# EAGLE design BeagleQ-v03 (EAGLE 6.4)
BOARD_NUMBER: 1.0
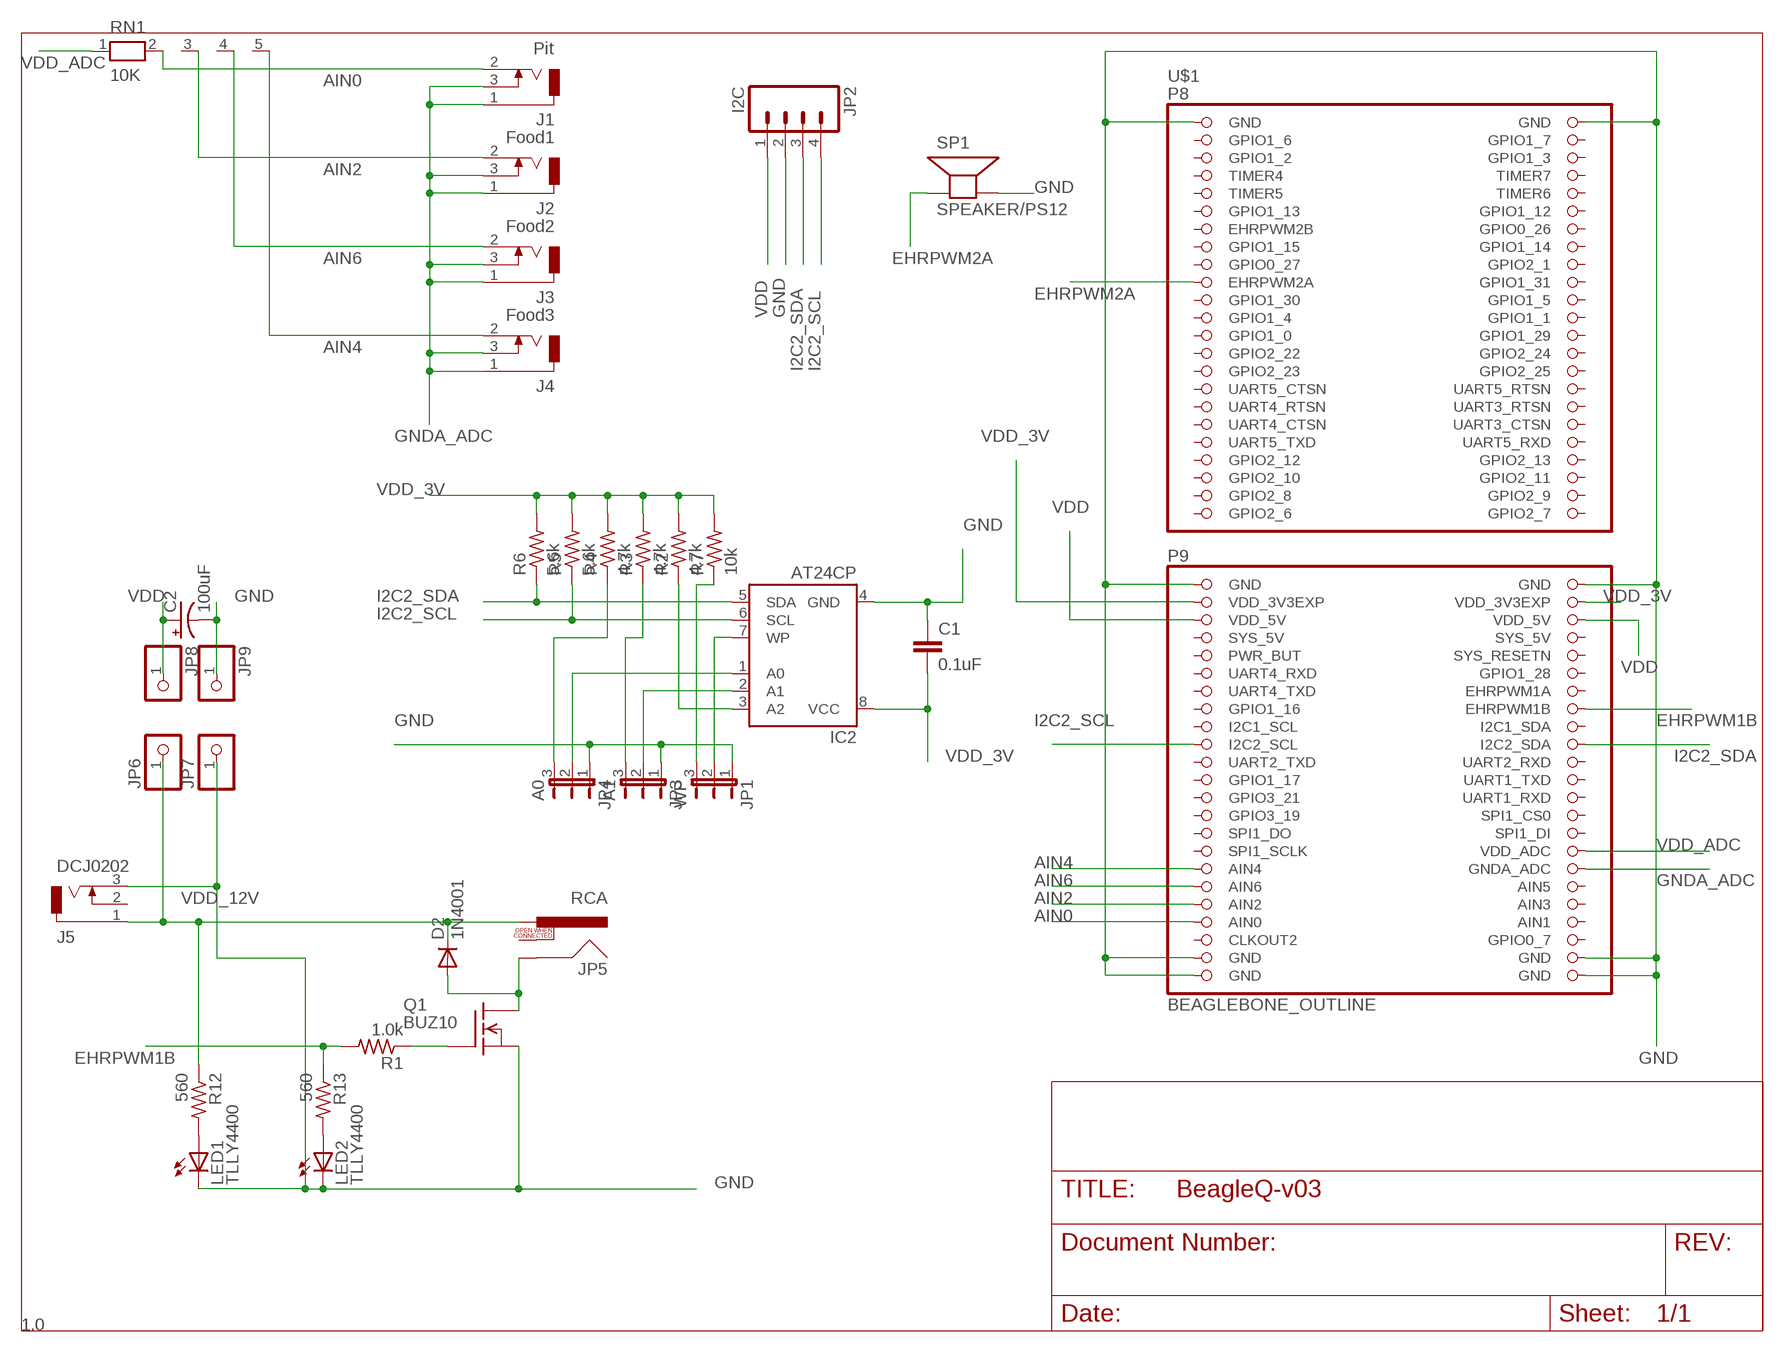
[diagram p0: schematic, sheet 1]
FRAME1 (LETTER_L): BOARD_NUMBER: 1.0

## Parts
C1  0.1uF  C2.5/2  [C2.5-2]
C2  100uF  CPOL-USE2,5-6E  [E2,5-6E]
D2  1N4001  1N4004  [DO41-10]
IC2  AT24CP  [DIL08]
J1  Pit  DCJ0202  [DCJ0202]
J2  Food1  DCJ0202  [DCJ0202]
J3  Food2  DCJ0202  [DCJ0202]
J4  Food3  DCJ0202  [DCJ0202]
J5  DCJ0202  [DCJ0202]
JP1  WP  JP2E  [JP2]
JP2  I2C  M04PTH  [1X04]
JP3  A1  JP2E  [JP2]
JP4  A0  JP2E  [JP2]
JP5  RCA  [RCA]
JP6  PINHD-1X1  [1X01]
JP7  PINHD-1X1  [1X01]
JP8  PINHD-1X1  [1X01]
JP9  PINHD-1X1  [1X01]
LED1  TLLY4400  [LED3MM]
LED2  TLLY4400  [LED3MM]
Q1  BUZ10  [TO220]
R1  1.0k  R-US_0207/10  [0207/10]
R2  4.7k  R-US_0207/10  [0207/10]
R3  4.7k  R-US_0207/10  [0207/10]
R4  4.7k  R-US_0207/10  [0207/10]
R5  5.6k  R-US_0207/10  [0207/10]
R6  5.6k  R-US_0207/10  [0207/10]
R7  10k  R-US_0207/10  [0207/10]
R12  560  R-US_0207/10  [0207/10]
R13  560  R-US_0207/10  [0207/10]
RN1  10K  RN04  [RN-5]
SP1  SPEAKER/PS12  [PS12]
U$1  BEAGLEBONE_OUTLINE  [BEAGLEBONE_SHIELD]

## Nets
AIN0: J1.2 RN1.2 U$1.85(AIN0)
AIN2: J2.2 RN1.3 U$1.83(AIN2)
AIN4: J4.2 RN1.5 U$1.79(AIN4)
AIN6: J3.2 RN1.4 U$1.81(AIN6)
BLOWER_L [VCC_12V]: D2.A JP5.SHELL Q1.2(D)
EHRPWM1B: R1.2 R13.1 U$1.62(EHRPWM1B)
EHRPWM2A: SP1.P$1(+) U$1.19(EHRPWM2A)
GND [GND]: C1.1 C2.- IC2.4(GND) J5.3 JP1.1 JP2.2 JP3.1 JP4.1 JP7.1 JP9.1 LED1.K(C) LED2.K(C) Q1.3(S) SP1.P$2(-) U$1.1(GND) U$1.2(GND) U$1.47(GND) U$1.48(GND) U$1.89(GND) U$1.90(GND) U$1.91(GND) U$1.92(GND)
GNDA_ADC: J1.1 J1.3 J2.1 J2.3 J3.1 J3.3 J4.1 J4.3 U$1.80(GNDA_ADC)
I2C2_SCL: IC2.6(SCL) JP2.4 R5.1 U$1.65(I2C2_SCL)
I2C2_SDA: IC2.5(SDA) JP2.3 R6.1 U$1.66(I2C2_SDA)
N$1: IC2.2(A1) JP3.2
N$2: IC2.1(A0) JP4.2
N$3: IC2.7(WP) JP1.2
N$4: Q1.1(G) R1.1
N$5: JP1.3 R7.1
N$6: JP3.3 R3.1
N$7: JP4.3 R4.1
N$8: LED1.A R12.2
N$9: IC2.3(A2) R2.1
N$10: LED2.A R13.2
VDD [VDD]: C2.+ JP2.1 JP8.1 U$1.51(VDD_5V) U$1.52(VDD_5V)
VDD_3V: C1.2 IC2.8(VCC) R2.2 R3.2 R4.2 R5.2 R6.2 R7.2 U$1.49(VDD_3V3EXP) U$1.50(VDD_3V3EXP)
VDD_12V [VCC_12V]: D2.C J5.1 JP5.PIN JP6.1 R12.1
VDD_ADC: RN1.1 U$1.78(VDD_ADC)
Unconnected: J5.2 JP5.SWITCH U$1.3(GPIO1_6) U$1.4(GPIO1_7) U$1.5(GPIO1_2) U$1.6(GPIO1_3) U$1.7(TIMER4) U$1.8(TIMER7) U$1.9(TIMER5) U$1.10(TIMER6) U$1.11(GPIO1_13) U$1.12(GPIO1_12) U$1.13(EHRPWM2B) U$1.14(GPIO0_26) U$1.15(GPIO1_15) U$1.16(GPIO1_14) U$1.17(GPIO0_27) U$1.18(GPIO2_1) U$1.20(GPIO1_31) U$1.21(GPIO1_30) U$1.22(GPIO1_5) U$1.23(GPIO1_4) U$1.24(GPIO1_1) U$1.25(GPIO1_0) U$1.26(GPIO1_29) U$1.27(GPIO2_22) U$1.28(GPIO2_24) U$1.29(GPIO2_23) U$1.30(GPIO2_25) U$1.31(UART5_CTSN) U$1.32(UART5_RTSN) U$1.33(UART4_RTSN) U$1.34(UART3_RTSN) U$1.35(UART4_CTSN) U$1.36(UART3_CTSN) U$1.37(UART5_TXD) U$1.38(UART5_RXD) U$1.39(GPIO2_12) U$1.40(GPIO2_13) U$1.41(GPIO2_10) U$1.42(GPIO2_11) U$1.43(GPIO2_8) U$1.44(GPIO2_9) U$1.45(GPIO2_6) U$1.46(GPIO2_7) U$1.54(SYS_5V) U$1.55(PWR_BUT) U$1.56(SYS_RESETN) U$1.57(UART4_RXD) U$1.58(GPIO1_28) U$1.59(UART4_TXD) U$1.60(EHRPWM1A) U$1.61(GPIO1_16) U$1.63(I2C1_SCL) U$1.64(I2C1_SDA) U$1.67(UART2_TXD) U$1.68(UART2_RXD) U$1.69(GPIO1_17) U$1.70(UART1_TXD) U$1.71(GPIO3_21) U$1.72(UART1_RXD) U$1.73(GPIO3_19) U$1.74(SPI1_CS0) U$1.75(SPI1_DO) U$1.76(SPI1_DI) U$1.77(SPI1_SCLK) U$1.82(AIN5) U$1.84(AIN3) U$1.86(AIN1) U$1.87(CLKOUT2) U$1.88(GPIO0_7)

## Power pins joined to a net without a drawn wire
SYS_5V: U$1.53(SYS_5V)

## Library data of the parts
C1 = capacitor-wima:C: CAPACITOR naming: grid - package width
C2 = rcl:CPOL-US: POLARIZED CAPACITOR, American symbol
D2 = adafruit:1N4004: DIODE General purpose 1N400x type rectifier (With bigger pads) http://www.ladyada.net/library/pcb/eaglelibrary.html
IC2 = atmel:AT24C*: 2-wire serial EEPROM; MPN: AT24C1024BW-SH-B; OC_FARNELL: 1362646; OC_NEWARK: 03P2044
J1-J4 = houseofbeck:DCJ0202: AUDIO JACK Source: MJ2508.pdf
J5 = con-jack:DCJ0202: DC POWER JACK Source: DCJ0202.pdf; OC_FARNELL: unknown; OC_NEWARK: unknown
JP1 JP3 JP4 = jumper:JP2E: JUMPER
JP2 = SparkFun-Connectors:M04: Header 4 Standard 4-pin 0.1" header. Use with straight break away headers (SKU : PRT-00116), right angle break away headers (PRT-00553), swiss pins (PRT-00743), machine pins (PRT-00117), and female headers (PRT-00115). Molex polarized connector foot print use with SKU : PRT-08231 with associated crimp pins and housings. 1MM SMD Version SKU: PRT-10208
JP5 = SparkFun-Connectors:RCA
JP6-JP9 = pinhead:PINHD-1X1: PIN HEADER
LED1 LED2 = led:TLLY4400: Low Current (2mA) LED 3 mm Tinted Diffused Package color YELLOW Source: Data sheet <http://www.farnell.com/datasheets/391098.pdf>; MF: VISHAY SEMICONDUCTOR; OC_FARNELL: 1612439
Q1 = transistor-fet:BUZ10: N-Channel Enhancement MOSFET 50V; 20A; 0,080Ohm
R1-R7 R12 R13 = resistor:R-US_: RESISTOR, American symbol
RN1 = resistor-net:RN04: RESISTOR NETWORK; OC_FARNELL: unknown; OC_NEWARK: unknown
SP1 = adafruit:SPEAKER: SPEAKER Source: Buerklin Added PS12 (for part # PS1240 piezo) http://www.ladyada.net/library/pcb/eaglelibrary.html
U$1 = houseofbeck:BEAGLEBONE_OUTLINE: Should match A3 pinout - but not completely tested

## Net classes
0 default: width 0.203 mm
1 VCC_12V: width 0.305 mm, drill 0.406 mm
2 VDD: width 0.305 mm, drill 0.406 mm
3 GND: width 0.254 mm, drill 0.406 mm

## Board
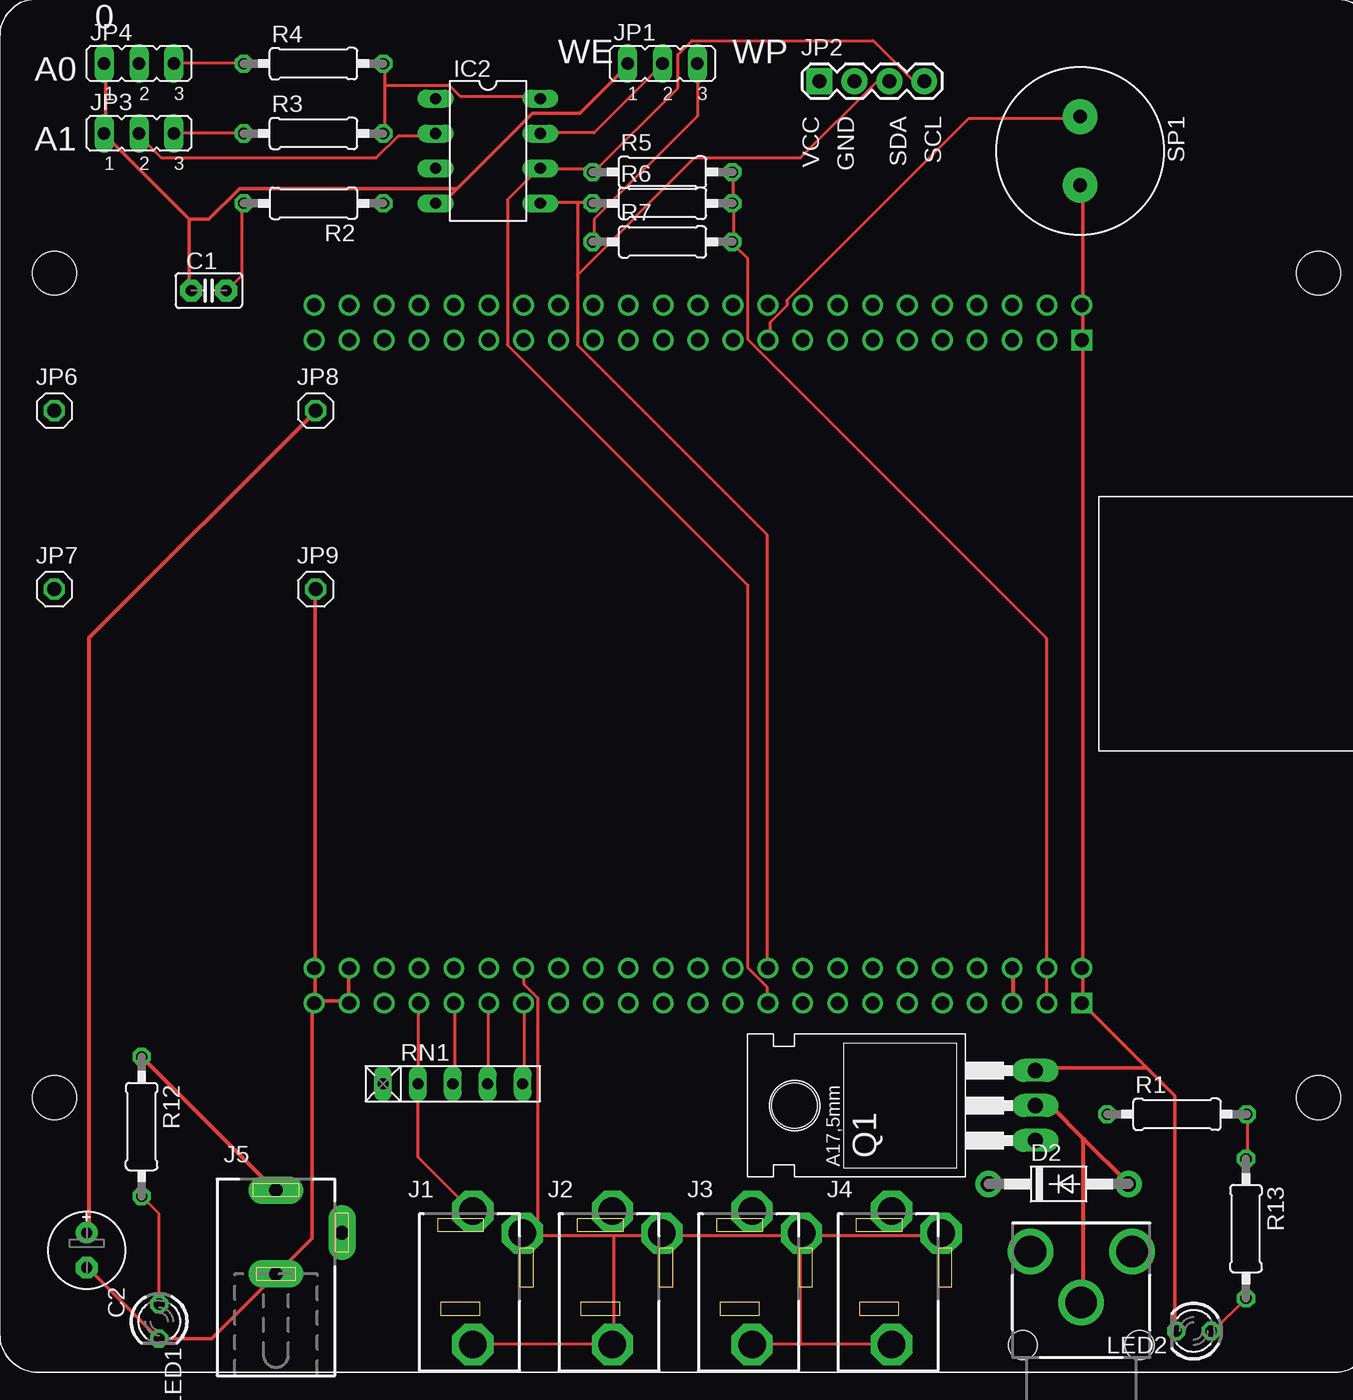
[diagram p1: board, top side]
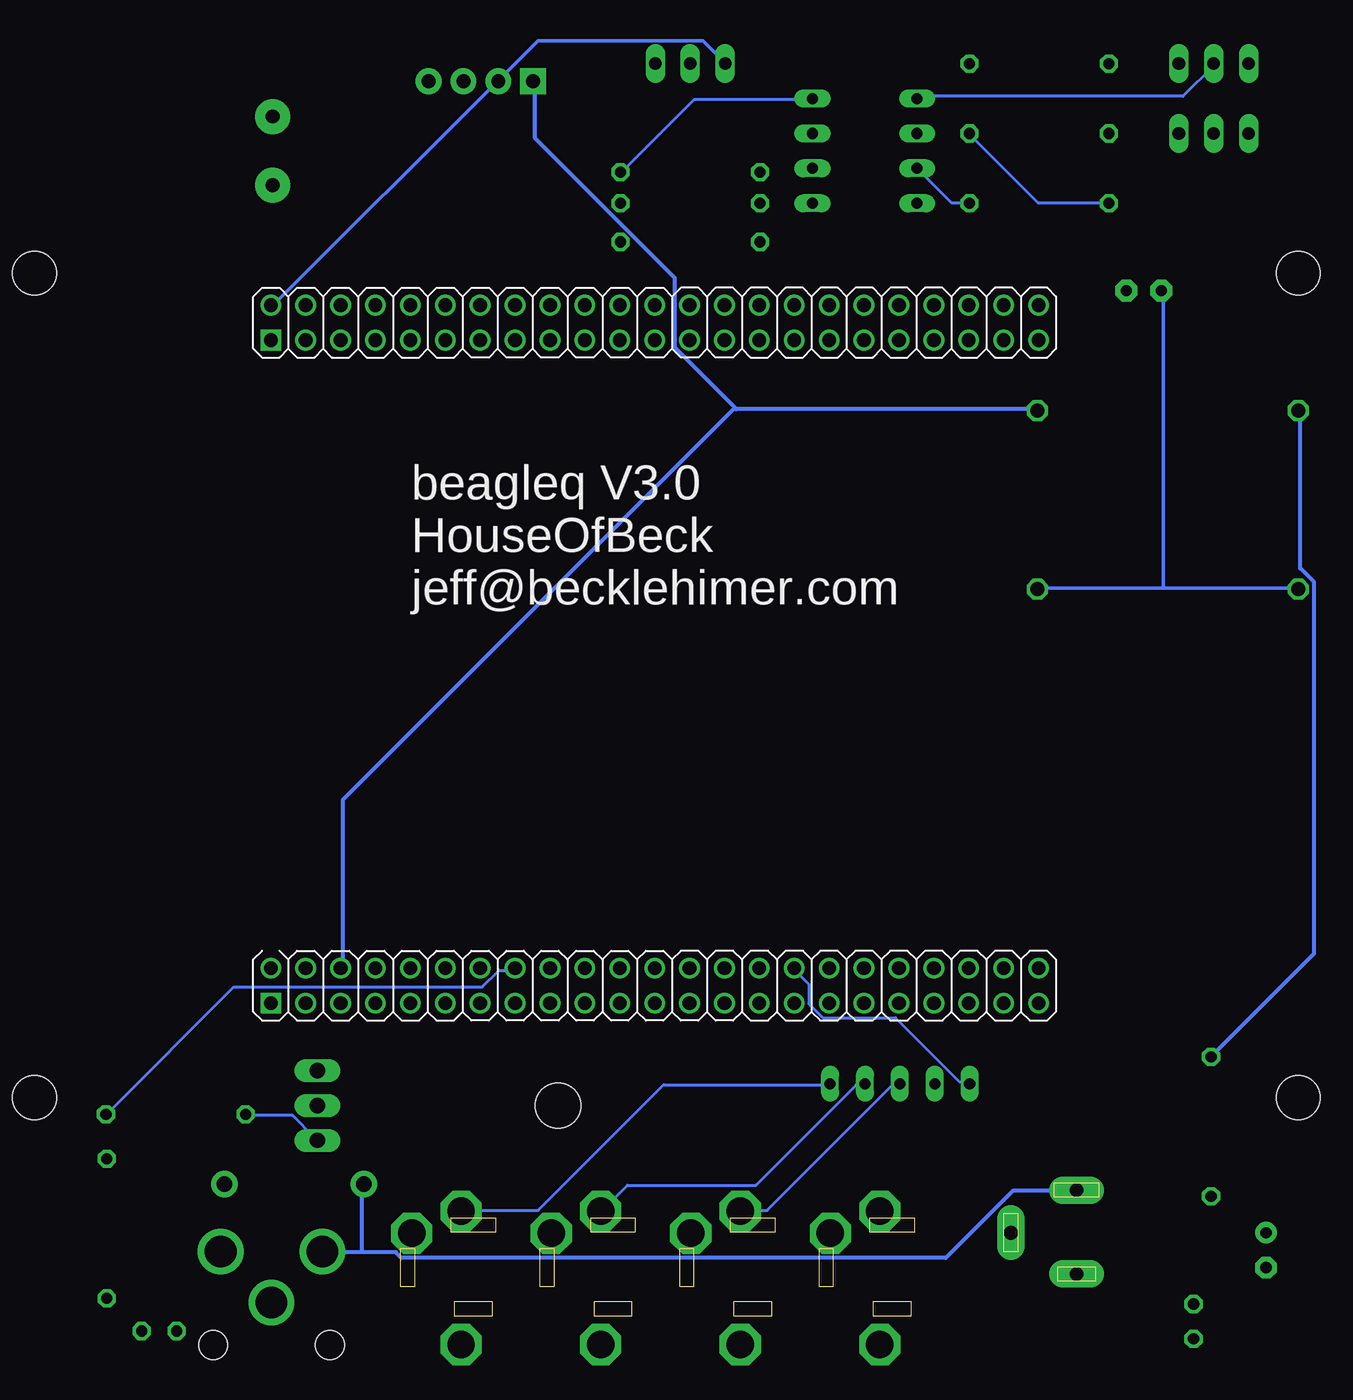
[diagram p2: board, bottom side, seen from below]

No outline drawn. Coordinates in mm, seen from the top.
Copper layers (1*16): Top 0.035mm / dielectric 1.5mm / Bottom 0.035mm
Design rules "dirt_cheap_dirty_boards.v1": minimum track width 5mil, minimum drill 12mil, track to track 5mil, track to pad 5mil, pad to pad 5mil, via to via 5mil, smd to smd 0mil, copper to edge 10mil, drill to drill 10mil, minimum pad ring 10mil, minimum via ring 6mil, stop-mask expansion 2mil, vias tented up to drill 25mil, thermal gap 10mil

### Footprints (pad centres in the part's own frame; a part is rotated, then mirrored left to right if it is on the bottom)
C2.5-2 = drill 0.813 pad 1.6 octagon: 1 -1.27,0; 2 1.27,0
E2,5-6E = drill 0.813 pad 1.575: + -1.27,0 | drill 0.813 pad 1.575 octagon: - 1.27,0
DO41-10 = drill 1.118 pad 1.93: A 5.08,0; C -5.08,0
DIL08 = drill 0.813 long: 1 -3.81,-3.81; 2 -1.27,-3.81; 3 1.27,-3.81; 4 3.81,-3.81; 5 3.81,3.81; 6 1.27,3.81; 7 -1.27,3.81; 8 -3.81,3.81
DCJ0202 = drill 2 pad 2.54 octagon: 1 0.9,-5.6; 2 0.9,4.1; 3 4.5,2.5
DCJ0202' = drill 1 pad 2 long: 1 0,3.1; 2 4.8,0; 3 0,-3
JP2 = drill 0.914 long: 1 -2.54,0; 2 0,0; 3 2.54,0
1X04 = drill 1.016 pad 1.88 square: 1 0,0 | drill 1.016 pad 1.88: 2 2.54,0; 3 5.08,0; 4 7.62,0
RCA = drill 2.3: PIN 3.7,3.7; SHELL 0,0; SWITCH 3.7,-3.7 | hole 2.1: -3.1,4.25; -3.1,-4.25
1X01 = drill 1.016 octagon: 1 0,0
LED3MM = drill 0.813 octagon: A -1.27,0; K 1.27,0
TO220 = drill 1.118 long: 1 -2.54,-6.35; 2 0,-6.35; 3 2.54,-6.35 | hole 3.302: 0,11.176
0207/10 = drill 0.813 octagon: 1 -5.08,0; 2 5.08,0
RN-5 = drill 0.813 long: 1 -5.08,0; 2 -2.54,0; 3 0,0; 4 2.54,0; 5 5.08,0
PS12 = drill 1 pad 2.54: P$1 -2.5,0; P$2 2.5,0
BEAGLEBONE_SHIELD = drill 1 square: 1 78.79,75.135; 47 78.79,26.875 | drill 1: 2 78.79,77.675; 3 76.25,75.135; 4 76.25,77.675; 5 73.71,75.135; 6 73.71,77.675; 7 71.17,75.135; 8 71.17,77.675; 9 68.63,75.135; 10 68.63,77.675; 11 66.09,75.135; 12 66.09,77.675; 13 63.55,75.135; 14 63.55,77.675; 15 61.01,75.135; 16 61.01,77.675; 17 58.47,75.135; 18 58.47,77.675; 19 55.93,75.135; 20 55.93,77.675; 21 53.39,75.135; 22 53.39,77.675; 23 50.85,75.135; 24 50.85,77.675; 25 48.31,75.135; 26 48.31,77.675; 27 45.77,75.135; 28 45.77,77.675; 29 43.23,75.135; 30 43.23,77.675; 31 40.69,75.135; 32 40.69,77.675; 33 38.15,75.135; 34 38.15,77.675; 35 35.61,75.135; 36 35.61,77.675; 37 33.07,75.135; 38 33.07,77.675; 39 30.53,75.135; 40 30.53,77.675; 41 27.99,75.135; 42 27.99,77.675; 43 25.45,75.135; 44 25.45,77.675; 45 22.91,75.135; 46 22.91,77.675; 48 78.79,29.415; 49 76.25,26.875; 50 76.25,29.415; 51 73.71,26.875; 52 73.71,29.415; 53 71.17,26.875; 54 71.17,29.415; 55 68.63,26.875; 56 68.63,29.415; 57 66.09,26.875; 58 66.09,29.415; 59 63.55,26.875; 60 63.55,29.415; 61 61.01,26.875; 62 61.01,29.415; 63 58.47,26.875; 64 58.47,29.415; 65 55.93,26.875; 66 55.93,29.415; 67 53.39,26.875; 68 53.39,29.415; 69 50.85,26.875; 70 50.85,29.415; 71 48.31,26.875; 72 48.31,29.415; 73 45.77,26.875; 74 45.77,29.415; 75 43.23,26.875; 76 43.23,29.415; 77 40.69,26.875; 78 40.69,29.415; 79 38.15,26.875; 80 38.15,29.415; 81 35.61,26.875; 82 35.61,29.415; 83 33.07,26.875; 84 33.07,29.415; 85 30.53,26.875; 86 30.53,29.415; 87 27.99,26.875; 88 27.99,29.415; 89 25.45,26.875; 90 25.45,29.415; 91 22.91,26.875; 92 22.91,29.415 | hole 3.2: 4,80; 96,80; 96,20; 4,20

### Placement (x,y rotation side)
C1  15.24,78.74 0 top
C2  6.35,8.89 270 top
D2  77.09,13.71 0 top
IC2  35.56,88.9 270 top
J1  33.56,7.62 0 top
J2  43.72,7.62 0 top
J3  53.88,7.62 0 top
J4  64.04,7.62 0 top
J5  DCJ0202  [DCJ0202']  20.13,10.16 0 top
JP1  48.26,95.25 0 top
JP2  59.69,93.98 0 top
JP3  10.16,90.17 0 top
JP4  10.16,95.25 0 top
JP5  78.74,5.08 90 top
JP6  4,70 0 top
JP7  4,57 0 top
JP8  23,70 0 top
JP9  23,57 0 top
LED1  11.62,3.7 270 top
LED2  86.92,3 180 top
Q1  69.05,19.42 90 top
R1  85.71,18.78 0 top
R2  22.86,85.09 180 top
R3  22.86,90.17 0 top
R4  22.86,95.25 0 top
R5  48.26,87.36 0 top
R6  48.26,85.09 0 top
R7  48.26,82.28 0 top
R12  10.35,17.89 270 top
R13  90.73,10.46 270 top
RN1  33,21 0 top
SP1  78.66,88.9 270 top
U$1  0,0 0 top

### Tracks (layer width: path | path; a pad name or v marks a point on that pad's centre or on a via)
AIN0
  Top 0.203: U$1.85 30.48,26.82 30.48,21.13 RN1.2 30.48,20.93 30.48,15.65 34.34,11.79 J1.2
AIN2
  Top 0.203: RN1.3 33.12,21.13 33.12,26.82 U$1.83
  Bottom 0.203: RN1.3 33.12,20.93 33.53,20.93 42.67,11.79 44.5,11.79 J2.2
AIN4
  Top 0.203: RN1.5 38.2,21.13 38.2,26.82 U$1.79
  Bottom 0.203: RN1.5 38.2,20.93 50.19,20.93 59.33,11.79 64.82,11.79 J4.2
AIN6
  Top 0.203: RN1.4 35.56,21.13 35.56,26.82 U$1.81
  Bottom 0.203: RN1.4 35.56,20.93 36.17,20.93 43.48,13.61 52.83,13.61 54.66,11.79 J3.2
BLOWER_L
  Top 0.305: 75.39,19.3 Q1.2 75.59,19.3 76.61,19.3 78.94,16.97 | 78.94,16.97 82.09,13.82 D2.A | JP5.SHELL 78.84,5.08 78.84,16.87 78.94,16.97
EHRPWM1B
  Top 0.203: R13.1 90.83,15.65 90.83,18.69 R1.2
  Bottom 0.203: U$1.62 61.16,29.26 62.18,29.26 63.4,28.04 81.48,28.04 90.63,18.9 R1.2
EHRPWM2A
  Top 0.203: U$1.19 56.08,75.18 56.08,76.4 57.3,77.62 57.3,78.03 70.51,91.24 78.64,91.24 SP1.P$1
GND
  Top 0.254: 22.96,27.03 22.96,29.26 U$1.92 22.96,29.46 22.96,56.9 JP9.1 | 25.4,27.03 25.4,29.26 U$1.90 | 25.4,27.03 22.96,27.03 | 22.96,27.03 U$1.91 22.76,26.82 22.76,9.75 20.32,7.32 J5.3 20.12,7.11 15.44,2.44 11.79,2.44 LED1.K 11.58,2.44 6.5,7.52 C2.- | 25.4,27.03 U$1.89 | JP4.1 7.72,95.1 7.72,90.22 JP3.1 7.72,90.02 13.82,83.92 | 13.82,83.92 13.82,78.84 C1.1 | 83.52,22.15 78.84,26.82 U$1.47 78.84,27.03 78.84,29.26 U$1.48 78.84,29.46 78.84,74.98 U$1.1 78.84,75.18 78.84,77.62 U$1.2 78.84,77.83 78.84,86.36 SP1.P$2 | 83.52,22.15 75.59,22.15 Q1.3 | 33.33,86.16 38.81,91.64 42.27,91.64 45.72,95.1 JP1.1 | 33.33,86.16 32.31,85.14 31.9,85.14 IC2.4 | 13.82,83.92 15.24,83.92 17.48,86.16 33.33,86.16 | 83.52,22.15 85.55,20.12 85.55,3.05 LED2.K
  Bottom 0.254: 13.82,57.1 22.96,57.1 JP9.1 | 13.82,57.1 4.06,57.1 JP7.1 | 13.82,57.1 13.82,78.64 C1.1 | JP1.1 45.72,95.3 47.35,96.93 59.33,96.93 62.18,94.08 JP2.2 62.38,93.88 78.64,77.62 U$1.2
GNDA_ADC
  Top 0.203: 58.32,2.03 64.82,2.03 J4.1 | 58.32,2.03 54.86,2.03 J3.1 | 58.32,2.03 58.32,9.96 | J4.3 68.48,9.96 58.52,9.96 J3.3 58.32,9.96 | J1.1 34.54,2.03 44.5,2.03 J2.1 44.7,2.03 44.7,9.96 | U$1.80 38.2,29.26 38.2,28.25 39.22,27.23 39.22,11.18 38.2,10.16 J1.3 38.2,9.96 44.7,9.96 | 44.7,9.96 48.16,9.96 J2.3 48.36,9.96 58.32,9.96
I2C2_SCL
  Top 0.203: U$1.65 55.88,27.03 55.88,28.04 54.46,29.46 54.46,57.3 36.98,74.78 36.98,85.34 39.22,87.58 IC2.6 39.42,87.58 42.88,87.58 43.08,87.38 R5.1 43.28,87.38 49.38,93.47 49.38,95.91 50.39,96.93 63.6,96.93 66.45,94.08 67.26,94.08 JP2.4
I2C2_SDA
  Top 0.203: 42.06,85.14 43.08,85.14 R6.1 | 42.06,85.14 39.42,85.14 IC2.5 | 42.06,85.14 42.06,79.86 | 42.06,79.86 42.06,74.78 55.88,60.96 55.88,29.46 U$1.66 | 42.06,79.86 50.6,88.39 58.32,88.39 63.8,93.88 64.62,93.88 JP2.3
N$1
  Top 0.203: IC2.2 31.7,90.02 29.06,90.02 27.43,88.39 11.79,88.39 10.16,90.02 JP3.2
N$2
  Bottom 0.203: IC2.1 31.7,92.86 12.39,92.86 10.16,95.1 JP4.2
N$3
  Top 0.203: IC2.7 39.42,90.22 43.28,90.22 48.16,95.1 JP1.2
N$4
  Bottom 0.203: R1.1 80.47,18.69 77.22,18.69 75.59,17.07 Q1.1
N$5
  Top 0.203: JP1.3 50.8,91.44 43.28,83.92 43.28,82.3 R7.1
N$6
  Top 0.203: R3.1 17.68,90.22 12.8,90.22 JP3.3
N$7
  Top 0.203: R4.1 17.68,95.3 12.8,95.3 JP4.3
N$8
  Top 0.203: LED1.A 11.58,5.08 11.58,11.58 10.36,12.8 R12.2
N$9
  Bottom 0.203: IC2.3 29.26,85.14 28.04,85.14 R2.1
N$10
  Top 0.203: LED2.A 88.39,3.05 90.63,5.28 R13.2
VDD
  Top 0.305: U$1.51 73.76,27.03 73.76,29.26 U$1.52 | C2.+ 6.5,10.16 6.5,53.44 22.96,69.9 JP8.1
  Bottom 0.305: 45.01,70.21 44.91,70.1 23.16,70.1 JP8.1 | 45.01,70.21 49.38,74.57 49.38,79.65 59.54,89.81 59.54,93.88 JP2.1 | 45.01,70.21 73.56,41.66 73.56,29.46 U$1.52
VDD_3V
  Top 0.203: R2.2 17.68,84.94 17.68,79.86 16.66,78.84 C1.2 | 28.04,93.67 28.04,95.1 R4.2 | 28.04,93.67 28.04,90.22 R3.2 | 28.04,93.67 32.72,93.67 33.53,92.86 39.22,92.86 IC2.8 | U$1.49 76.2,27.03 76.2,29.26 U$1.50 76.2,29.46 76.2,53.44 54.46,75.18 54.46,81.08 53.44,82.09 R7.2 53.44,82.3 53.44,84.94 R6.2 53.44,85.14 53.44,87.17 R5.2
  Bottom 0.203: R2.2 17.88,85.14 22.96,85.14 27.84,90.02 R3.2 | IC2.8 39.42,92.66 47.95,92.66 53.24,87.38 R5.2
VDD_12V
  Top 0.305: R12.1 10.36,22.96 20.12,13.21 J5.1
  Bottom 0.305: JP6.1 3.86,69.9 3.86,58.52 2.85,57.51 2.85,30.48 10.16,23.16 R12.1 | 72.14,8.74 69.7,8.74 69.29,8.33 29.67,8.33 24.79,13.21 20.32,13.21 J5.1 | 72.14,8.74 74.98,8.74 JP5.PIN | 72.14,8.74 72.14,13.61 D2.C
VDD_ADC
  Bottom 0.203: RN1.1 28.04,21.13 28.65,21.13 33.33,25.81 38.61,25.81 39.62,26.82 39.62,28.25 40.64,29.26 U$1.78

### Text on the board
tPlace: 0 | WE | WP | A0 | VCC | GND | SDA | SCL | A1
bPlace: beagleq V3.0 / HouseOfBeck / jeff@becklehimer.com
tOrigins: 1